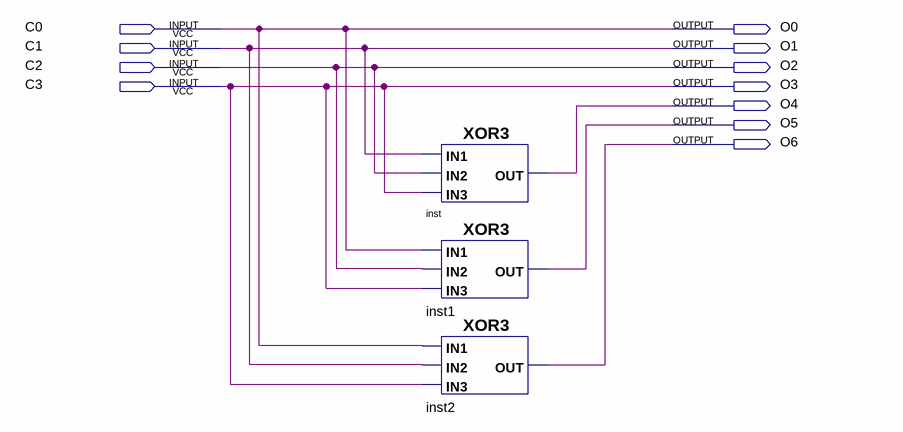
[diagram p0: schematic sheet]
// Quartus schematic GMatrix.bdf as structural Verilog: 3 symbols, 11 pins
module GMatrix (
  input  C0,
  input  C1,
  input  C2,
  input  C3,
  output O0,
  output O1,
  output O2,
  output O3,
  output O4,
  output O5,
  output O6
);

  XOR3 inst (.IN3(C3), .IN1(C1), .IN2(C2), .OUT(O4));
  XOR3 inst1 (.IN3(C3), .IN1(C0), .IN2(C2), .OUT(O5));
  XOR3 inst2 (.IN3(C3), .IN1(C0), .IN2(C1), .OUT(O6));

  assign O0 = C0;
  assign O1 = C1;
  assign O2 = C2;
  assign O3 = C3;
endmodule
